# EAGLE design Digit control (EAGLE 6.3)
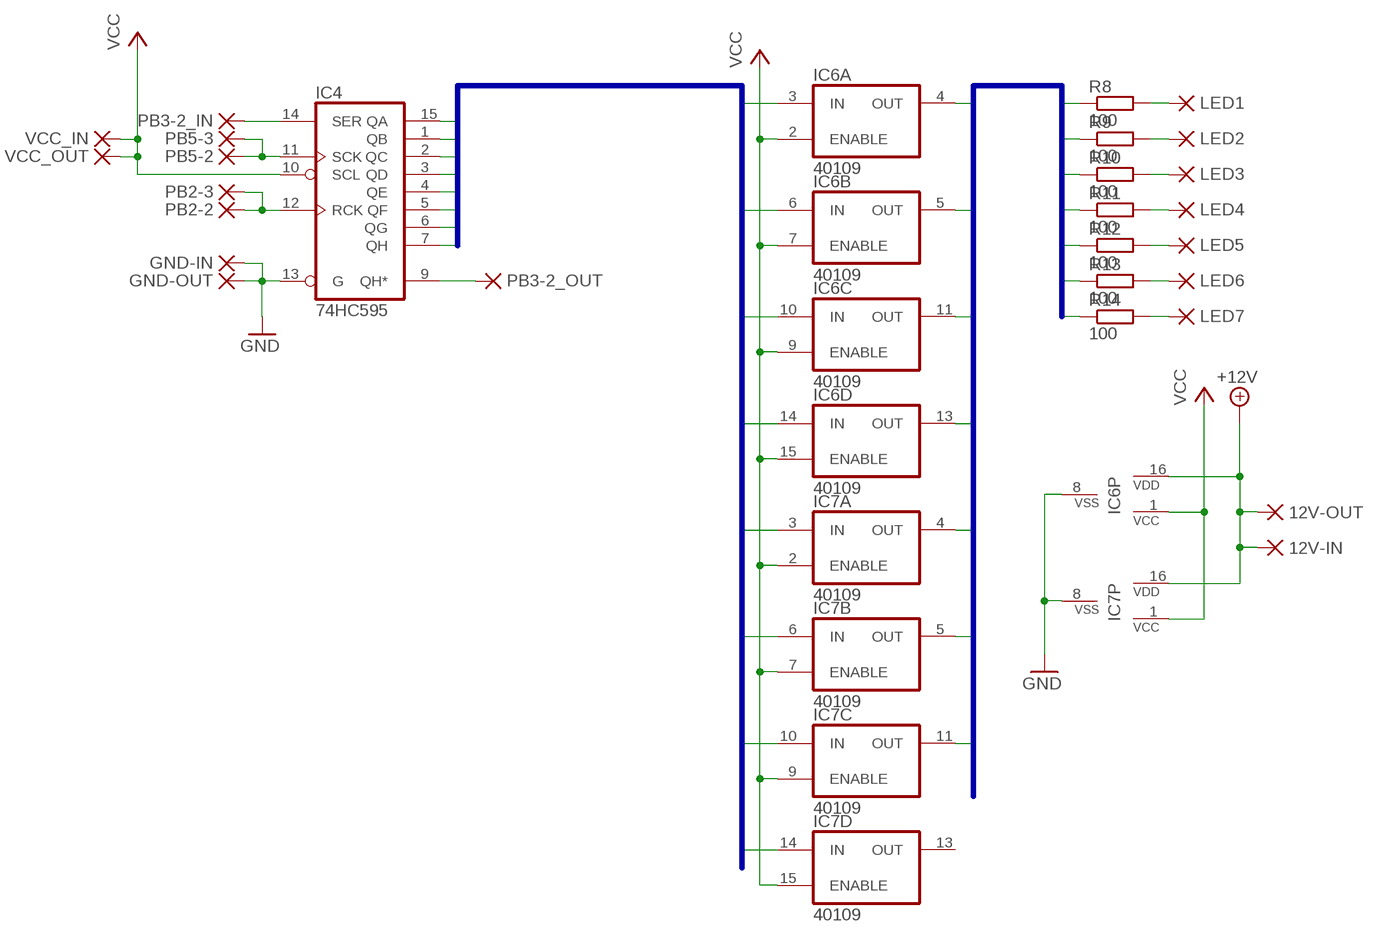
[diagram p0: schematic, sheet 1]

## Parts
12V-IN  PAD-0500  [0500]
12V-OUT  PAD-0500  [0500]
GND-IN  PAD-0500  [0500]
GND-OUT  PAD-0500  [0500]
IC4  74HC595  74LS595N  [DIL16]
IC6  40109  [DIL16]
IC7  40109  [DIL16]
LED1  PAD-0400  [0400]
LED2  PAD-0400  [0400]
LED3  PAD-0400  [0400]
LED4  PAD-0400  [0400]
LED5  PAD-0400  [0400]
LED6  PAD-0400  [0400]
LED7  PAD-0400  [0400]
PB2-2  PAD-0400  [0400]
PB2-3  PAD-0400  [0400]
PB3-2_IN  PAD-0400  [0400]
PB3-2_OUT  PAD-0400  [0400]
PB5-2  PAD-0400  [0400]
PB5-3  PAD-0400  [0400]
R8  100  R-EU_0309/15  [0309/15]
R9  100  R-EU_0309/15  [0309/15]
R10  100  R-EU_0309/15  [0309/15]
R11  100  R-EU_0309/15  [0309/15]
R12  100  R-EU_0309/15  [0309/15]
R13  100  R-EU_0309/15  [0309/15]
R14  100  R-EU_0309/15  [0309/15]
VCC_IN  PAD-0500  [0500]
VCC_OUT  PAD-0500  [0500]

## Nets
+12V: 12V-IN.P$1(P) 12V-OUT.P$1(P) IC6.16(P:VDD) IC7.16(P:VDD)
GND: GND-IN.P$1(P) GND-OUT.P$1(P) IC4.13(G) IC6.8(P:VSS) IC7.8(P:VSS)
LED1: IC6.4(A:OUT) R8.1
LED2: IC6.5(B:OUT) R9.1
LED3: IC6.11(C:OUT) R10.1
LED4: IC6.13(D:OUT) R11.1
LED5: IC7.4(A:OUT) R12.1
LED6: IC7.5(B:OUT) R13.1
LED7: IC7.11(C:OUT) R14.1
LED_INPUT1: IC4.15(QA) IC6.3(A:IN)
LED_INPUT2: IC4.1(QB) IC6.6(B:IN)
LED_INPUT3: IC4.2(QC) IC6.10(C:IN)
LED_INPUT4: IC4.3(QD) IC6.14(D:IN)
LED_INPUT5: IC4.4(QE) IC7.3(A:IN)
LED_INPUT6: IC4.5(QF) IC7.6(B:IN)
LED_INPUT7: IC4.6(QG) IC7.10(C:IN)
LED_INPUT8: IC4.7(QH) IC7.14(D:IN)
N$1: IC4.14(SER) PB3-2_IN.P$1(P)
N$3: LED1.P$1(P) R8.2
N$4: IC4.11(SCK) PB5-2.P$1(P) PB5-3.P$1(P)
N$5: IC4.12(RCK) PB2-2.P$1(P) PB2-3.P$1(P)
N$6: IC4.9(QH*) PB3-2_OUT.P$1(P)
N$7: LED7.P$1(P) R14.2
N$8: LED6.P$1(P) R13.2
N$10: LED5.P$1(P) R12.2
N$11: LED4.P$1(P) R11.2
N$12: LED3.P$1(P) R10.2
N$13: LED2.P$1(P) R9.2
VCC: IC4.10(SCL) IC6.1(P:VCC) IC6.2(A:ENABLE) IC6.7(B:ENABLE) IC6.9(C:ENABLE) IC6.15(D:ENABLE) IC7.1(P:VCC) IC7.2(A:ENABLE) IC7.7(B:ENABLE) IC7.9(C:ENABLE) IC7.15(D:ENABLE) VCC_IN.P$1(P) VCC_OUT.P$1(P)
Unconnected: IC7.13(D:OUT)

## Buses
LED[1..7]
LED_INPUT[1..8]

## Power pins joined to a net without a drawn wire
GND: IC4.8(GND)
VCC: IC4.16(VCC)

## Library data of the parts
12V-IN 12V-OUT GND-IN GND-OUT LED1-LED7 PB2-2 PB2-3 PB3-2_IN PB3-2_OUT PB5-2 PB5-3 VCC_IN VCC_OUT = ~~dpads:PAD: WIRE PAD Standard US Drill Sizes and SMD pads
IC4 = 74xx-us:74*595: 8-bit SHIFT REGISTER, output latch
IC6 IC7 = ~~40xx-2:40109
R8-R14 = ~~rcl:R-EU_: RESISTOR, European symbol

## Board
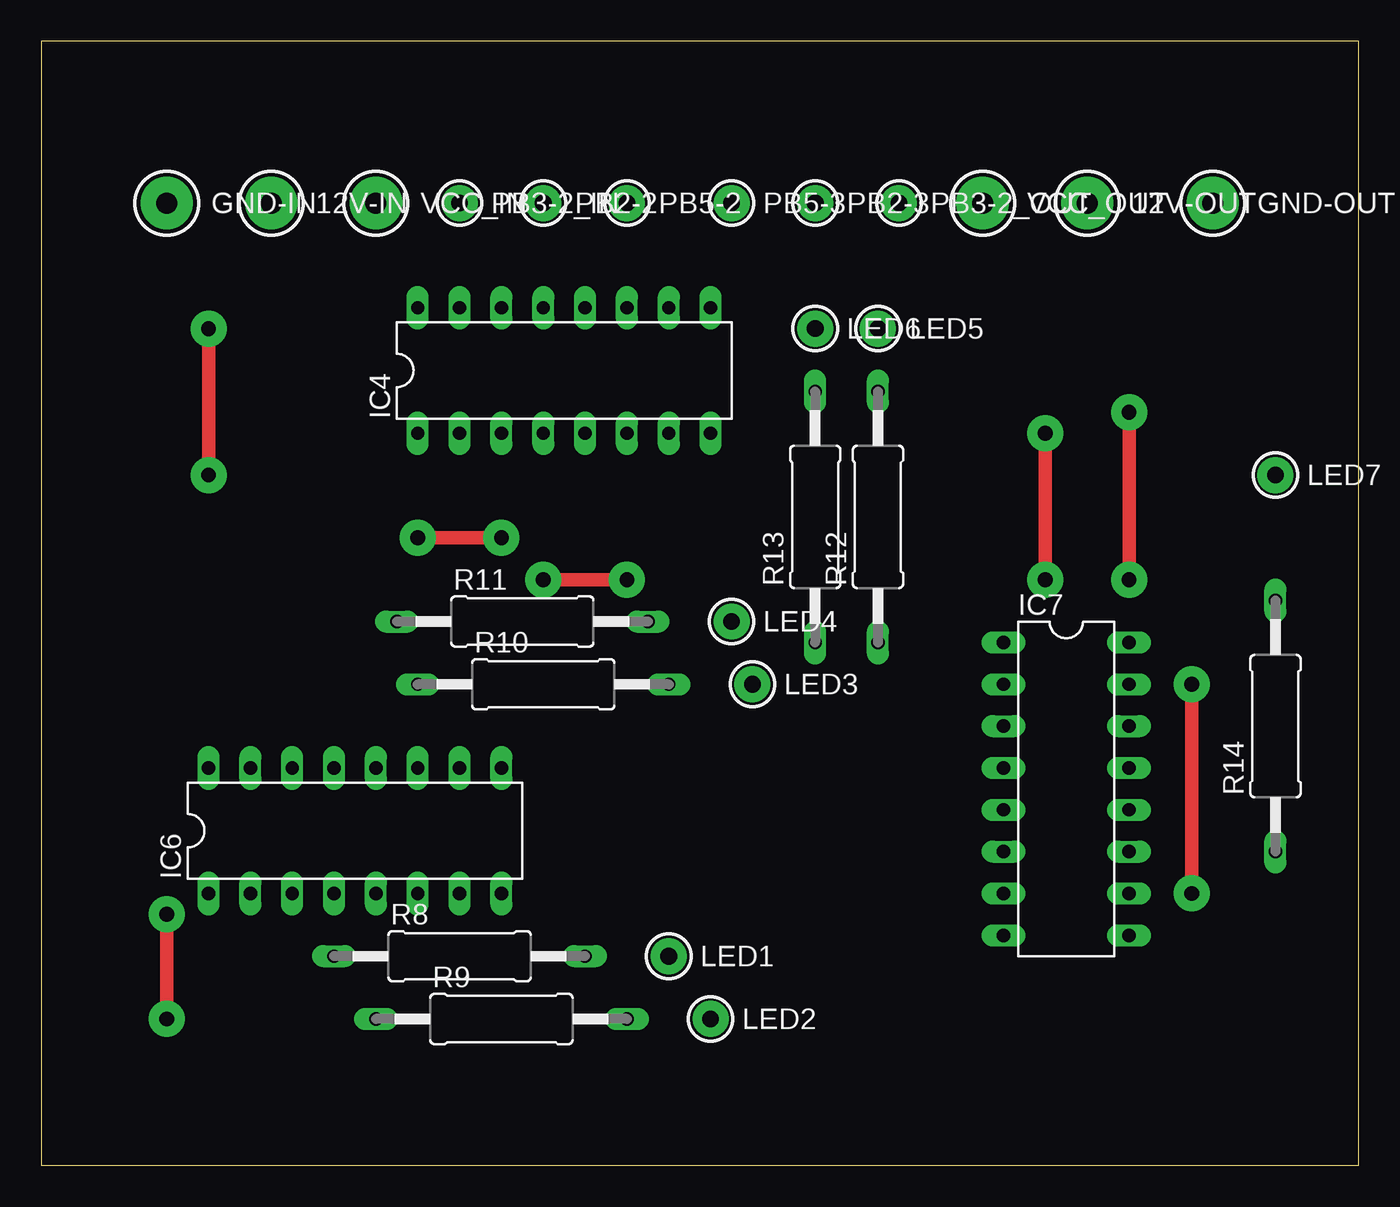
[diagram p1: board, top side]
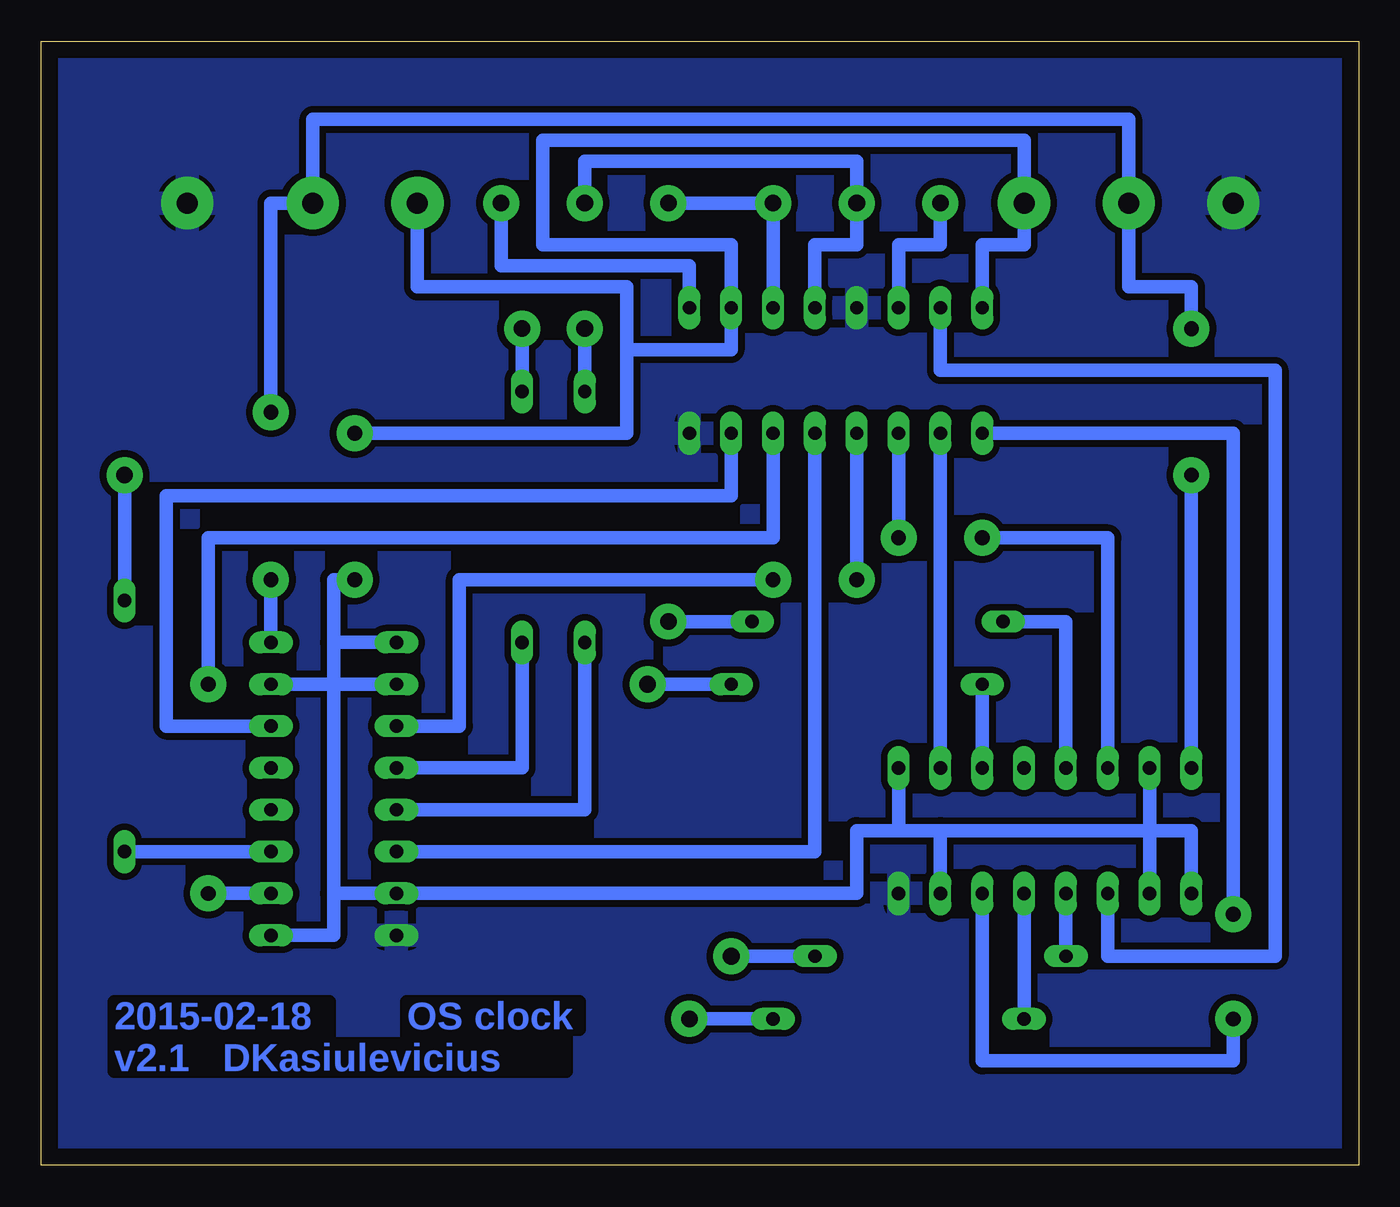
[diagram p2: board, bottom side, seen from below]

Size 79.99 x 68.25 mm. Coordinates in mm from the lower left corner, seen from the top.
Outline: 0,0 79.99,0 79.99,68.25 0,68.25 0,0
Copper layers (1+16): Top 0.035mm / dielectric 1.5mm / Bottom 0.035mm
Design rules "stori *": minimum track width 20mil, minimum drill 24mil, track to track 16mil, track to pad 16mil, pad to pad 16mil, via to via 16mil, smd to smd 16mil, copper to edge 40mil, drill to drill 16mil, minimum pad ring 10mil, minimum via ring 8mil, stop-mask expansion 4mil, vias tented up to drill 0mil, thermal gap 10mil

### Footprints (pad centres in the part's own frame; a part is rotated, then mirrored left to right if it is on the bottom)
0500 = drill 1.27 pad 3.175: P$1 0,0
DIL16 = drill 0.813 long: 1 -8.89,-3.81; 2 -6.35,-3.81; 3 -3.81,-3.81; 4 -1.27,-3.81; 5 1.27,-3.81; 6 3.81,-3.81; 7 6.35,-3.81; 8 8.89,-3.81; 9 8.89,3.81; 10 6.35,3.81; 11 3.81,3.81; 12 1.27,3.81; 13 -1.27,3.81; 14 -3.81,3.81; 15 -6.35,3.81; 16 -8.89,3.81
0400 = drill 1.016 pad 2.184: P$1 0,0
0309/15 = drill 0.813 long: 1 -7.62,0; 2 7.62,0

### Placement (x,y rotation side)
12V-IN  13.97,58.42 0 top
12V-OUT  63.5,58.42 0 top
GND-IN  7.62,58.42 0 top
GND-OUT  71.12,58.42 0 top
IC4  31.75,48.26 0 top
IC6  19.05,20.32 0 top
IC7  62.23,22.86 270 top
LED1  38.1,12.7 0 top
LED2  40.64,8.89 0 top
LED3  43.18,29.21 0 top
LED4  41.91,33.02 0 top
LED5  50.8,50.8 0 top
LED6  46.99,50.8 0 top
LED7  74.93,41.91 0 top
PB2-2  30.48,58.42 0 top
PB2-3  46.99,58.42 0 top
PB3-2_IN  25.4,58.42 0 top
PB3-2_OUT  52.07,58.42 0 top
PB5-2  35.56,58.42 0 top
PB5-3  41.91,58.42 0 top
R8  25.4,12.7 0 top
R9  27.94,8.89 0 top
R10  30.48,29.21 0 top
R11  29.21,33.02 0 top
R12  50.8,39.37 90 top
R13  46.99,39.37 90 top
R14  74.93,26.67 90 top
VCC_IN  20.32,58.42 0 top
VCC_OUT  57.15,58.42 0 top

### Tracks (layer width: path | path; a pad name or v marks a point on that pad's centre or on a via)
+12V  (via drill 0.9 pad 2.18)
  Top 0.813: v10.16,41.91 v10.16,50.8 | v66.04,45.72 v66.04,35.56
  Bottom 0.813: IC6.16 v10.16,41.91 | IC7.16 v66.04,35.56 | v10.16,50.8 10.16,53.34 13.97,53.34 12V-IN.P$1 13.97,63.5 63.5,63.5 12V-OUT.P$1 66.04,58.42 v66.04,45.72
GND
  pour Bottom: 1.27,67.31 78.74,67.31 78.74,1.27 1.27,1.27
LED1
  Bottom 0.813: R8.1 IC6.4
LED2
  Bottom 0.813: R9.1 IC6.5
LED3
  Bottom 0.813: R10.1 IC6.11
LED4
  Bottom 0.813: IC6.13 17.78,33.02 R11.1
LED5
  Bottom 0.813: IC7.4 50.8,24.13 R12.1
LED6
  Bottom 0.813: R13.1 46.99,21.59 IC7.5
LED7
  Bottom 0.813: IC7.11 R14.1
LED_INPUT1
  Bottom 0.813: IC4.15 25.4,48.26 5.08,48.26 5.08,12.7 15.24,12.7 IC6.3
LED_INPUT2  (via drill 0.9 pad 2.18)
  Top 0.813: v7.62,15.24 v7.62,8.89
  Bottom 0.813: IC6.6 22.86,6.35 7.62,6.35 v7.62,8.89 | IC4.1 7.62,44.45 v7.62,15.24
LED_INPUT3
  Bottom 0.813: IC4.2 IC6.10
LED_INPUT4  (via drill 0.9 pad 2.18)
  Top 0.813: v22.86,38.1 v27.94,38.1
  Bottom 0.813: IC4.3 v27.94,38.1 | IC6.14 15.24,38.1 v22.86,38.1
LED_INPUT5  (via drill 0.9 pad 2.18)
  Top 0.813: v30.48,35.56 v35.56,35.56
  Bottom 0.813: IC4.4 v30.48,35.56 | IC7.3 54.61,26.67 54.61,35.56 v35.56,35.56
LED_INPUT6
  Bottom 0.813: IC4.5 33.02,19.05 IC7.6
LED_INPUT7  (via drill 0.9 pad 2.18)
  Top 0.813: v69.85,29.21 v69.85,16.51
  Bottom 0.813: IC4.6 35.56,38.1 69.85,38.1 v69.85,29.21 | IC7.10 v69.85,16.51
LED_INPUT8
  Bottom 0.813: IC4.7 38.1,40.64 72.39,40.64 72.39,26.67 IC7.14
N$1
  Bottom 0.813: IC4.14 27.94,55.88 25.4,55.88 PB3-2_IN.P$1
N$3
  Bottom 0.813: LED1.P$1 R8.2
N$4
  Bottom 0.813: IC4.11 PB5-2.P$1 PB5-3.P$1
N$5
  Bottom 0.813: IC4.12 33.02,55.88 30.48,55.88 PB2-2.P$1 30.48,60.96 46.99,60.96 PB2-3.P$1
N$6
  Bottom 0.813: IC4.9 40.64,54.61 52.07,54.61 PB3-2_OUT.P$1
N$7
  Bottom 0.813: R14.2 LED7.P$1
N$8
  Bottom 0.813: R13.2 LED6.P$1
N$10
  Bottom 0.813: R12.2 LED5.P$1
N$11
  Bottom 0.813: R11.2 LED4.P$1
N$12
  Bottom 0.813: R10.2 LED3.P$1
N$13
  Bottom 0.813: LED2.P$1 R9.2
VCC  (via drill 0.9 pad 2.18)
  Top 0.813: v60.96,44.45 v60.96,35.56
  Bottom 0.813: 62.23,31.75 62.23,35.56 v60.96,35.56 | 62.23,31.75 62.23,29.21 | 62.23,29.21 IC7.15 | IC7.2 62.23,29.21 | 62.23,29.21 62.23,16.51 | 62.23,16.51 62.23,13.97 IC7.9 | IC6.9 27.94,20.32 | 27.94,20.32 25.4,20.32 | IC6.7 25.4,20.32 | 25.4,20.32 12.7,20.32 | 12.7,20.32 IC6.15 | IC6.2 12.7,20.32 | 12.7,20.32 10.16,20.32 IC6.1 | 62.23,16.51 IC7.7 30.48,16.51 30.48,20.32 27.94,20.32 | 44.45,49.53 38.1,49.53 IC4.10 38.1,55.88 49.53,55.88 49.53,62.23 20.32,62.23 VCC_IN.P$1 20.32,55.88 22.86,55.88 IC4.16 | 44.45,49.53 44.45,44.45 v60.96,44.45 | VCC_OUT.P$1 57.15,53.34 44.45,53.34 44.45,49.53 | IC7.1 62.23,31.75

### Text on the board
Bottom: OS clock | 2015-02-18 | v2.1 DKasiulevicius